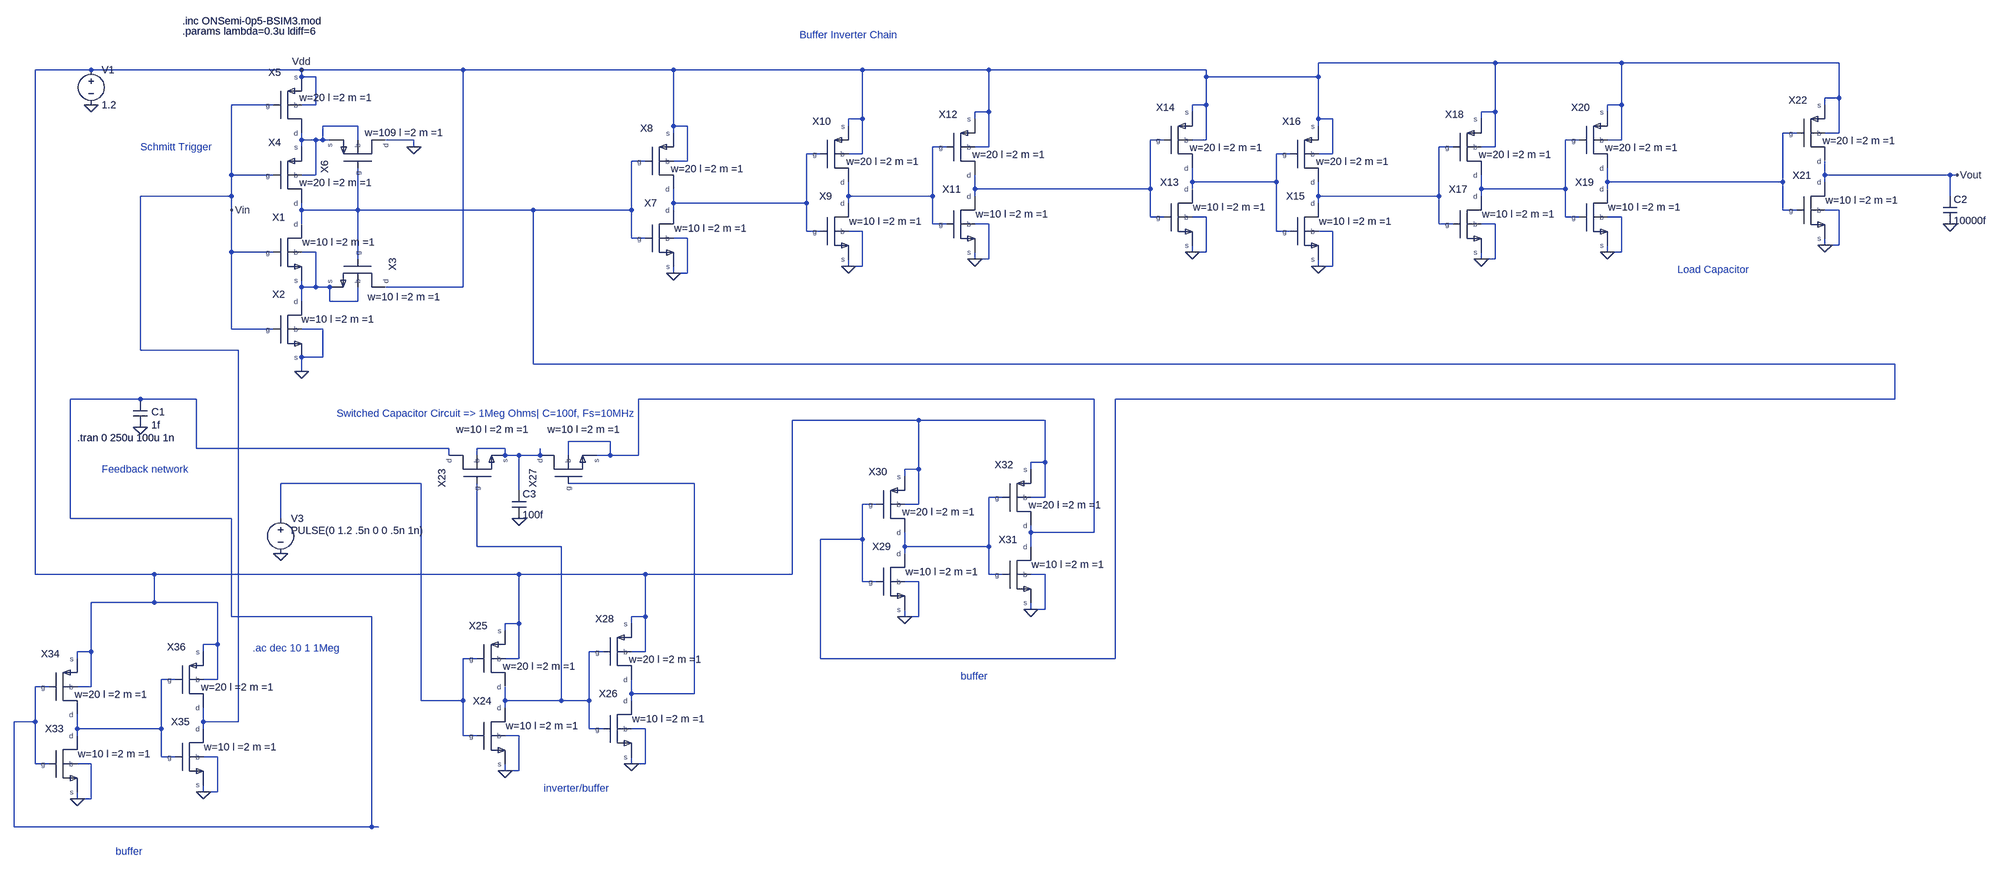
[diagram p0: schematic ECSE426_dp1.asc]
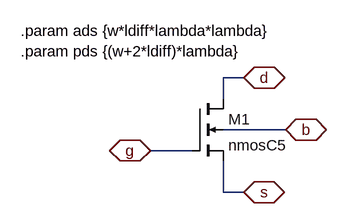
[diagram p1: sub-circuit cmosn.asc]
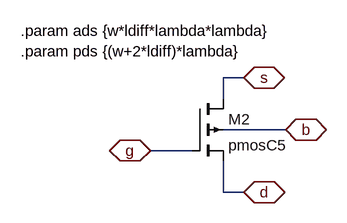
[diagram p2: sub-circuit cmosp.asc]
ECSE426_dp1.asc, the LTspice schematic file:
Version 4
SHEET 1 4220 1496
WIRE 3072 -320 2544 -320
WIRE 3360 -320 3072 -320
WIRE 3856 -320 3360 -320
WIRE -352 -304 -480 -304
WIRE 128 -304 -352 -304
WIRE 496 -304 128 -304
WIRE 976 -304 496 -304
WIRE 1504 -304 976 -304
WIRE 1792 -304 1504 -304
WIRE 2288 -304 1792 -304
WIRE 128 -288 128 -304
WIRE 160 -288 128 -288
WIRE 2288 -288 2288 -304
WIRE 2544 -288 2544 -320
WIRE 2544 -288 2288 -288
WIRE 3856 -240 3856 -320
WIRE 3856 -240 3824 -240
WIRE 64 -224 -32 -224
WIRE 160 -224 160 -288
WIRE 160 -224 128 -224
WIRE 2288 -224 2288 -288
WIRE 2288 -224 2256 -224
WIRE 3360 -224 3360 -320
WIRE 3360 -224 3328 -224
WIRE 3824 -224 3824 -240
WIRE 1792 -208 1792 -304
WIRE 1792 -208 1760 -208
WIRE 2256 -208 2256 -224
WIRE 3072 -208 3072 -320
WIRE 3072 -208 3040 -208
WIRE 3328 -208 3328 -224
WIRE 1504 -192 1504 -304
WIRE 1504 -192 1472 -192
WIRE 1760 -192 1760 -208
WIRE 2544 -192 2544 -288
WIRE 2576 -192 2544 -192
WIRE 3040 -192 3040 -208
WIRE 256 -176 176 -176
WIRE 976 -176 976 -304
WIRE 1008 -176 976 -176
WIRE 1472 -176 1472 -192
WIRE 2544 -176 2544 -192
WIRE 976 -160 976 -176
WIRE 3760 -160 3728 -160
WIRE 3856 -160 3856 -240
WIRE 3856 -160 3824 -160
WIRE 128 -144 128 -160
WIRE 160 -144 128 -144
WIRE 176 -144 176 -176
WIRE 176 -144 160 -144
WIRE 192 -144 176 -144
WIRE 256 -144 256 -176
WIRE 384 -144 320 -144
WIRE 2192 -144 2160 -144
WIRE 2288 -144 2288 -224
WIRE 2288 -144 2256 -144
WIRE 3264 -144 3232 -144
WIRE 3360 -144 3360 -224
WIRE 3360 -144 3328 -144
WIRE 128 -128 128 -144
WIRE 384 -128 384 -144
WIRE 1696 -128 1664 -128
WIRE 1792 -128 1792 -208
WIRE 1792 -128 1760 -128
WIRE 2976 -128 2944 -128
WIRE 3072 -128 3072 -208
WIRE 3072 -128 3040 -128
WIRE 1408 -112 1376 -112
WIRE 1504 -112 1504 -192
WIRE 1504 -112 1472 -112
WIRE 2480 -112 2448 -112
WIRE 2576 -112 2576 -192
WIRE 2576 -112 2544 -112
WIRE 912 -96 880 -96
WIRE 1008 -96 1008 -176
WIRE 1008 -96 976 -96
WIRE -32 -64 -32 -224
WIRE 64 -64 -32 -64
WIRE 160 -64 160 -144
WIRE 160 -64 128 -64
WIRE 3824 -64 3824 -96
WIRE 4128 -64 3824 -64
WIRE 4144 -64 4128 -64
WIRE 2256 -48 2256 -80
WIRE 2448 -48 2448 -112
WIRE 2448 -48 2256 -48
WIRE 3328 -48 3328 -80
WIRE 3728 -48 3728 -160
WIRE 3728 -48 3328 -48
WIRE 3824 -48 3824 -64
WIRE 1760 -32 1760 -64
WIRE 2160 -32 2160 -144
WIRE 2160 -32 1760 -32
WIRE 2256 -32 2256 -48
WIRE 3040 -32 3040 -64
WIRE 3232 -32 3232 -144
WIRE 3232 -32 3040 -32
WIRE 3328 -32 3328 -48
WIRE -32 -16 -32 -64
WIRE -32 -16 -240 -16
WIRE 1472 -16 1472 -48
WIRE 1664 -16 1664 -128
WIRE 1664 -16 1472 -16
WIRE 1760 -16 1760 -32
WIRE 2544 -16 2544 -48
WIRE 2944 -16 2944 -128
WIRE 2944 -16 2544 -16
WIRE 3040 -16 3040 -32
WIRE 4128 -16 4128 -64
WIRE 976 0 976 -32
WIRE 1376 0 1376 -112
WIRE 1376 0 976 0
WIRE 1472 0 1472 -16
WIRE 2544 0 2544 -16
WIRE -32 16 -32 -16
WIRE 128 16 128 0
WIRE 256 16 256 -80
WIRE 256 16 128 16
WIRE 656 16 256 16
WIRE 880 16 880 -96
WIRE 880 16 656 16
WIRE 976 16 976 0
WIRE 3728 16 3728 -48
WIRE 3760 16 3728 16
WIRE 3856 16 3824 16
WIRE 2160 32 2160 -32
WIRE 2192 32 2160 32
WIRE 2288 32 2256 32
WIRE 3232 32 3232 -32
WIRE 3264 32 3232 32
WIRE 3360 32 3328 32
WIRE 128 48 128 16
WIRE 1664 48 1664 -16
WIRE 1696 48 1664 48
WIRE 1792 48 1760 48
WIRE 2944 48 2944 -16
WIRE 2976 48 2944 48
WIRE 3072 48 3040 48
WIRE 1376 64 1376 0
WIRE 1408 64 1376 64
WIRE 1504 64 1472 64
WIRE 2448 64 2448 -48
WIRE 2480 64 2448 64
WIRE 2576 64 2544 64
WIRE 880 80 880 16
WIRE 912 80 880 80
WIRE 1008 80 976 80
WIRE 3824 96 3824 80
WIRE 3856 96 3856 16
WIRE 3856 96 3824 96
WIRE -32 112 -32 16
WIRE 64 112 -32 112
WIRE 160 112 128 112
WIRE 2256 112 2256 96
WIRE 2288 112 2288 32
WIRE 2288 112 2256 112
WIRE 3328 112 3328 96
WIRE 3360 112 3360 32
WIRE 3360 112 3328 112
WIRE 256 128 256 16
WIRE 1760 128 1760 112
WIRE 1792 128 1792 48
WIRE 1792 128 1760 128
WIRE 3040 128 3040 112
WIRE 3072 128 3072 48
WIRE 3072 128 3040 128
WIRE 1472 144 1472 128
WIRE 1504 144 1504 64
WIRE 1504 144 1472 144
WIRE 2544 144 2544 128
WIRE 2576 144 2576 64
WIRE 2576 144 2544 144
WIRE 976 160 976 144
WIRE 1008 160 1008 80
WIRE 1008 160 976 160
WIRE 128 192 128 176
WIRE 160 192 160 112
WIRE 160 192 128 192
WIRE 192 192 160 192
WIRE 496 192 496 -304
WIRE 496 192 320 192
WIRE 128 224 128 192
WIRE 192 224 192 192
WIRE 256 224 256 192
WIRE 256 224 192 224
WIRE -32 288 -32 112
WIRE 64 288 -32 288
WIRE 176 288 128 288
WIRE -240 336 -240 -16
WIRE -16 336 -240 336
WIRE 176 352 176 288
WIRE 176 352 128 352
WIRE 656 368 656 16
WIRE 3984 368 656 368
WIRE 128 384 128 352
WIRE -240 448 -400 448
WIRE -112 448 -240 448
WIRE 2032 448 896 448
WIRE 3984 448 3984 368
WIRE 3984 448 2080 448
WIRE 1632 496 1344 496
WIRE 1920 496 1632 496
WIRE 832 544 736 544
WIRE -112 560 -112 448
WIRE 464 560 -112 560
WIRE 592 560 528 560
WIRE 464 576 464 560
WIRE 528 576 528 560
WIRE 592 576 592 560
WIRE 624 576 592 576
WIRE 672 576 672 560
WIRE 672 576 624 576
WIRE 736 576 736 544
WIRE 832 576 832 544
WIRE 832 576 800 576
WIRE 896 576 896 448
WIRE 896 576 832 576
WIRE 1920 592 1920 496
WIRE 1920 592 1888 592
WIRE 1632 608 1632 496
WIRE 1632 608 1600 608
WIRE 1888 608 1888 592
WIRE 1600 624 1600 608
WIRE 400 640 80 640
WIRE 1024 640 736 640
WIRE 624 656 624 576
WIRE 1824 672 1792 672
WIRE 1920 672 1920 592
WIRE 1920 672 1888 672
WIRE 1536 688 1504 688
WIRE 1632 688 1632 608
WIRE 1632 688 1600 688
WIRE -400 720 -400 448
WIRE -32 720 -400 720
WIRE 80 720 80 640
WIRE 1888 752 1888 736
WIRE 2032 752 2032 448
WIRE 2032 752 1888 752
WIRE 1504 768 1504 688
WIRE 1504 768 1408 768
WIRE 528 784 528 640
WIRE 720 784 528 784
WIRE 1600 784 1600 752
WIRE 1792 784 1792 672
WIRE 1792 784 1600 784
WIRE 1888 784 1888 752
WIRE 1600 800 1600 784
WIRE -480 848 -480 -304
WIRE -208 848 -480 848
WIRE 624 848 -208 848
WIRE 912 848 624 848
WIRE 1344 848 1344 496
WIRE 1344 848 912 848
WIRE 1792 848 1792 784
WIRE 1824 848 1792 848
WIRE 1920 848 1888 848
WIRE 1504 864 1504 768
WIRE 1536 864 1504 864
WIRE 1632 864 1600 864
WIRE -208 912 -208 848
WIRE -208 912 -352 912
WIRE -64 912 -208 912
WIRE 1888 928 1888 912
WIRE 1920 928 1920 848
WIRE 1920 928 1888 928
WIRE -32 944 -32 720
WIRE 288 944 -32 944
WIRE 912 944 912 848
WIRE 912 944 880 944
WIRE 1600 944 1600 928
WIRE 1632 944 1632 864
WIRE 1632 944 1600 944
WIRE 624 960 624 848
WIRE 624 960 592 960
WIRE 880 960 880 944
WIRE 592 976 592 960
WIRE -64 1008 -64 912
WIRE -64 1008 -96 1008
WIRE -352 1024 -352 912
WIRE -352 1024 -384 1024
WIRE -96 1024 -96 1008
WIRE 816 1024 784 1024
WIRE 912 1024 912 944
WIRE 912 1024 880 1024
WIRE -384 1040 -384 1024
WIRE 528 1040 496 1040
WIRE 624 1040 624 960
WIRE 624 1040 592 1040
WIRE 1408 1040 1408 768
WIRE 2080 1040 2080 448
WIRE 2080 1040 1408 1040
WIRE -160 1088 -192 1088
WIRE -64 1088 -64 1008
WIRE -64 1088 -96 1088
WIRE -448 1104 -480 1104
WIRE -352 1104 -352 1024
WIRE -352 1104 -384 1104
WIRE 880 1120 880 1088
WIRE 1024 1120 1024 640
WIRE 1024 1120 880 1120
WIRE 400 1136 400 640
WIRE 496 1136 496 1040
WIRE 496 1136 400 1136
WIRE 592 1136 592 1104
WIRE 720 1136 720 784
WIRE 720 1136 592 1136
WIRE 784 1136 784 1024
WIRE 784 1136 720 1136
WIRE 880 1136 880 1120
WIRE 592 1152 592 1136
WIRE -480 1184 -480 1104
WIRE -480 1184 -528 1184
WIRE -96 1184 -96 1152
WIRE -16 1184 -16 336
WIRE -16 1184 -96 1184
WIRE -384 1200 -384 1168
WIRE -192 1200 -192 1088
WIRE -192 1200 -384 1200
WIRE -96 1200 -96 1184
WIRE 784 1200 784 1136
WIRE 816 1200 784 1200
WIRE 912 1200 880 1200
WIRE -384 1216 -384 1200
WIRE 496 1216 496 1136
WIRE 528 1216 496 1216
WIRE 624 1216 592 1216
WIRE -192 1264 -192 1200
WIRE -160 1264 -192 1264
WIRE -64 1264 -96 1264
WIRE -480 1280 -480 1184
WIRE -448 1280 -480 1280
WIRE -352 1280 -384 1280
WIRE 880 1280 880 1264
WIRE 912 1280 912 1200
WIRE 912 1280 880 1280
WIRE 592 1296 592 1280
WIRE 624 1296 624 1216
WIRE 624 1296 592 1296
WIRE -96 1344 -96 1328
WIRE -64 1344 -64 1264
WIRE -64 1344 -96 1344
WIRE -384 1360 -384 1344
WIRE -352 1360 -352 1280
WIRE -352 1360 -384 1360
WIRE -528 1424 -528 1184
WIRE 288 1424 288 944
WIRE 288 1424 -528 1424
WIRE 304 1424 288 1424
FLAG 128 384 0
FLAG 384 -128 0
FLAG -352 -224 0
FLAG 128 -304 Vdd
FLAG -32 16 Vin
FLAG -240 512 0
FLAG 976 160 0
FLAG 1472 144 0
FLAG 1760 128 0
FLAG 2256 112 0
FLAG 4128 48 0
FLAG 2544 144 0
FLAG 3040 128 0
FLAG 4144 -64 Vout
FLAG 3328 112 0
FLAG 3824 96 0
FLAG 624 720 0
FLAG 80 800 0
FLAG 592 1296 0
FLAG 880 1280 0
FLAG 1600 944 0
FLAG 1888 928 0
FLAG -384 1360 0
FLAG -96 1344 0
SYMBOL CMOSN 112 112 R0
WINDOW 39 101 -7 Bottom 2
SYMATTR SpiceLine w=10 l =2 m =1
SYMATTR InstName X1
SYMBOL CMOSN 112 288 R0
WINDOW 39 99 -7 Bottom 2
SYMATTR SpiceLine w=10 l =2 m =1
SYMATTR InstName X2
SYMBOL CMOSN 256 176 R90
WINDOW 39 23 -106 VTop 2
SYMATTR SpiceLine w=10 l =2 m =1
SYMATTR InstName X3
SYMBOL CMOSP 96 -64 R0
WINDOW 39 110 33 Bottom 2
SYMATTR SpiceLine w=20 l =2 m =1
SYMATTR InstName X4
SYMBOL CMOSP 96 -224 R0
WINDOW 39 110 -1 Bottom 2
SYMATTR SpiceLine w=20 l =2 m =1
SYMATTR InstName X5
SYMBOL CMOSP 256 -112 R270
WINDOW 39 33 106 VTop 2
SYMATTR SpiceLine w=109 l =2 m =1
SYMATTR InstName X6
SYMBOL voltage -352 -320 R0
WINDOW 123 0 0 Left 0
WINDOW 39 0 0 Left 0
SYMATTR InstName V1
SYMATTR Value 1.2
SYMBOL cap -256 448 R0
WINDOW 0 41 29 Left 2
WINDOW 3 41 59 Left 2
SYMATTR InstName C1
SYMATTR Value 1f
SYMBOL CMOSN 960 80 R0
WINDOW 39 101 -7 Bottom 2
SYMATTR SpiceLine w=10 l =2 m =1
SYMATTR InstName X7
SYMBOL CMOSP 944 -96 R0
WINDOW 39 110 33 Bottom 2
SYMATTR SpiceLine w=20 l =2 m =1
SYMATTR InstName X8
SYMBOL CMOSN 1456 64 R0
WINDOW 39 101 -7 Bottom 2
SYMATTR SpiceLine w=10 l =2 m =1
SYMATTR InstName X9
SYMBOL CMOSP 1440 -112 R0
WINDOW 39 110 33 Bottom 2
SYMATTR SpiceLine w=20 l =2 m =1
SYMATTR InstName X10
SYMBOL CMOSN 1744 48 R0
WINDOW 39 101 -7 Bottom 2
SYMATTR SpiceLine w=10 l =2 m =1
SYMATTR InstName X11
SYMBOL CMOSP 1728 -128 R0
WINDOW 39 110 33 Bottom 2
SYMATTR SpiceLine w=20 l =2 m =1
SYMATTR InstName X12
SYMBOL CMOSN 2240 32 R0
WINDOW 39 101 -7 Bottom 2
SYMATTR SpiceLine w=10 l =2 m =1
SYMATTR InstName X13
SYMBOL CMOSP 2224 -144 R0
WINDOW 39 110 33 Bottom 2
SYMATTR SpiceLine w=20 l =2 m =1
SYMATTR InstName X14
SYMBOL cap 4112 -16 R0
SYMATTR InstName C2
SYMATTR Value 10000f
SYMBOL CMOSN 2528 64 R0
WINDOW 39 101 -7 Bottom 2
SYMATTR SpiceLine w=10 l =2 m =1
SYMATTR InstName X15
SYMBOL CMOSP 2512 -112 R0
WINDOW 39 110 33 Bottom 2
SYMATTR SpiceLine w=20 l =2 m =1
SYMATTR InstName X16
SYMBOL CMOSN 3024 48 R0
WINDOW 39 101 -7 Bottom 2
SYMATTR SpiceLine w=10 l =2 m =1
SYMATTR InstName X17
SYMBOL CMOSP 3008 -128 R0
WINDOW 39 110 33 Bottom 2
SYMATTR SpiceLine w=20 l =2 m =1
SYMATTR InstName X18
SYMBOL CMOSN 3312 32 R0
WINDOW 39 101 -7 Bottom 2
SYMATTR SpiceLine w=10 l =2 m =1
SYMATTR InstName X19
SYMBOL CMOSP 3296 -144 R0
WINDOW 39 110 33 Bottom 2
SYMATTR SpiceLine w=20 l =2 m =1
SYMATTR InstName X20
SYMBOL CMOSN 3808 16 R0
WINDOW 39 101 -7 Bottom 2
SYMATTR SpiceLine w=10 l =2 m =1
SYMATTR InstName X21
SYMBOL CMOSP 3792 -160 R0
WINDOW 39 110 33 Bottom 2
SYMATTR SpiceLine w=20 l =2 m =1
SYMATTR InstName X22
SYMBOL cap 608 656 R0
SYMATTR InstName C3
SYMATTR Value 100f
SYMBOL voltage 80 704 R0
WINDOW 3 24 44 Left 2
WINDOW 123 24 72 Left 2
WINDOW 39 0 0 Left 0
SYMATTR Value PULSE(0 1.2 .5n 0 0 .5n 1n)
SYMATTR InstName V3
SYMBOL CMOSN 736 592 R270
WINDOW 39 60 36 VTop 2
SYMATTR SpiceLine w=10 l =2 m =1
SYMATTR InstName X27
SYMBOL CMOSN 528 592 R270
WINDOW 39 60 36 VTop 2
SYMATTR SpiceLine w=10 l =2 m =1
SYMATTR InstName X23
SYMBOL CMOSN 576 1216 R0
WINDOW 39 101 -7 Bottom 2
SYMATTR SpiceLine w=10 l =2 m =1
SYMATTR InstName X24
SYMBOL CMOSP 560 1040 R0
WINDOW 39 110 33 Bottom 2
SYMATTR SpiceLine w=20 l =2 m =1
SYMATTR InstName X25
SYMBOL CMOSN 864 1200 R0
WINDOW 39 101 -7 Bottom 2
SYMATTR SpiceLine w=10 l =2 m =1
SYMATTR InstName X26
SYMBOL CMOSP 848 1024 R0
WINDOW 39 110 33 Bottom 2
SYMATTR SpiceLine w=20 l =2 m =1
SYMATTR InstName X28
SYMBOL CMOSN 1584 864 R0
WINDOW 39 101 -7 Bottom 2
SYMATTR SpiceLine w=10 l =2 m =1
SYMATTR InstName X29
SYMBOL CMOSP 1568 688 R0
WINDOW 39 110 33 Bottom 2
SYMATTR SpiceLine w=20 l =2 m =1
SYMATTR InstName X30
SYMBOL CMOSN 1872 848 R0
WINDOW 39 101 -7 Bottom 2
SYMATTR SpiceLine w=10 l =2 m =1
SYMATTR InstName X31
SYMBOL CMOSP 1856 672 R0
WINDOW 39 110 33 Bottom 2
SYMATTR SpiceLine w=20 l =2 m =1
SYMATTR InstName X32
SYMBOL CMOSN -400 1280 R0
WINDOW 39 101 -7 Bottom 2
SYMATTR SpiceLine w=10 l =2 m =1
SYMATTR InstName X33
SYMBOL CMOSP -416 1104 R0
WINDOW 39 110 33 Bottom 2
SYMATTR SpiceLine w=20 l =2 m =1
SYMATTR InstName X34
SYMBOL CMOSN -112 1264 R0
WINDOW 39 101 -7 Bottom 2
SYMATTR SpiceLine w=10 l =2 m =1
SYMATTR InstName X35
SYMBOL CMOSP -128 1088 R0
WINDOW 39 110 33 Bottom 2
SYMATTR SpiceLine w=20 l =2 m =1
SYMATTR InstName X36
TEXT -144 -392 Left 2 !.params lambda=0.3u ldiff=6
TEXT -144 -416 Left 2 !.inc ONSemi-0p5-BSIM3.mod
TEXT -384 536 Left 2 !.tran 0 250u 100u 1n
TEXT 16 1016 Left 2 ;.ac dec 10 1 1Meg
TEXT 208 480 Left 2 ;Switched Capacitor Circuit => 1Meg Ohms| C=100f, Fs=10MHz
TEXT -240 -128 Left 2 ;Schmitt Trigger
TEXT 1360 -384 Left 2 ;Buffer Inverter Chain
TEXT 3488 152 Left 2 ;Load Capacitor
TEXT -328 608 Left 2 ;Feedback network
TEXT -296 1480 Left 2 ;buffer
TEXT 1728 1080 Left 2 ;buffer
TEXT 680 1336 Left 2 ;inverter/buffer

cmosn.asc, the sub-circuit schematic file:
Version 4
SHEET 1 1648 680
WIRE 240 144 208 144
WIRE 208 176 208 144
WIRE 304 224 208 224
WIRE 160 256 96 256
WIRE 208 320 208 272
WIRE 240 320 208 320
FLAG 96 256 g
IOPIN 96 256 BiDir
FLAG 240 144 d
IOPIN 240 144 BiDir
FLAG 240 320 s
IOPIN 240 320 BiDir
FLAG 304 224 b
IOPIN 304 224 BiDir
SYMBOL nmos4 160 176 R0
SYMATTR InstName M1
SYMATTR Value nmosC5
SYMATTR Value2 l={l*lambda} w={w*lambda} ad={ads} as={ads} pd={pds} ps={pds} m={m}
TEXT -104 72 Left 2 !.param ads {w*ldiff*lambda*lambda}\n.param pds {(w+2*ldiff)*lambda}

cmosp.asc, the sub-circuit schematic file:
Version 4
SHEET 1 1648 680
WIRE 240 144 208 144
WIRE 208 176 208 144
WIRE 304 224 208 224
WIRE 160 256 96 256
WIRE 208 320 208 272
WIRE 240 320 208 320
FLAG 96 256 g
IOPIN 96 256 BiDir
FLAG 240 320 d
IOPIN 240 320 BiDir
FLAG 240 144 s
IOPIN 240 144 BiDir
FLAG 304 224 b
IOPIN 304 224 BiDir
SYMBOL pmos4 160 176 R0
SYMATTR InstName M2
SYMATTR Value pmosC5
SYMATTR Value2 l={l*lambda} w={w*lambda} ad={ads} as={ads} pd={pds} ps={pds} m={m}
TEXT -104 72 Left 2 !.param ads {w*ldiff*lambda*lambda}\n.param pds {(w+2*ldiff)*lambda}

The netlist it stands for:
* ECSE426_dp1.asc
XX1 N010 N009 Vin N010 cmosn params: w=10 l =2 m =1
XX2 0 N010 Vin 0 cmosn params: w=10 l =2 m =1
XX3 N010 Vdd N009 N010 cmosn params: w=10 l =2 m =1
XX4 N001 N009 Vin N001 cmosp params: w=20 l =2 m =1
XX5 Vdd N001 Vin Vdd cmosp params: w=20 l =2 m =1
XX6 N001 0 N009 N001 cmosp params: w=109 l =2 m =1
V1 Vdd 0 1.2
C1 N011 0 1f
XX7 0 N007 N009 0 cmosn params: w=10 l =2 m =1
XX8 Vdd N007 N009 Vdd cmosp params: w=20 l =2 m =1
XX9 0 N005 N007 0 cmosn params: w=10 l =2 m =1
XX10 Vdd N005 N007 Vdd cmosp params: w=20 l =2 m =1
XX11 0 N003 N005 0 cmosn params: w=10 l =2 m =1
XX12 Vdd N003 N005 Vdd cmosp params: w=20 l =2 m =1
XX13 0 N008 N003 0 cmosn params: w=10 l =2 m =1
XX14 Vdd N008 N003 Vdd cmosp params: w=20 l =2 m =1
C2 Vout 0 10000f
XX15 0 N006 N008 0 cmosn params: w=10 l =2 m =1
XX16 Vdd N006 N008 Vdd cmosp params: w=20 l =2 m =1
XX17 0 N004 N006 0 cmosn params: w=10 l =2 m =1
XX18 Vdd N004 N006 Vdd cmosp params: w=20 l =2 m =1
XX19 0 N002 N004 0 cmosn params: w=10 l =2 m =1
XX20 Vdd N002 N004 Vdd cmosp params: w=20 l =2 m =1
XX21 0 Vout N002 0 cmosn params: w=10 l =2 m =1
XX22 Vdd Vout N002 Vdd cmosp params: w=20 l =2 m =1
C3 N013 0 100f
V3 N014 0 PULSE(0 1.2 .5n 0 0 .5n 1n)
XX27 N012 N013 N015 N012 cmosn params: w=10 l =2 m =1
XX23 N013 N011 N017 N013 cmosn params: w=10 l =2 m =1
XX24 0 N017 N014 0 cmosn params: w=10 l =2 m =1
XX25 Vdd N017 N014 Vdd cmosp params: w=20 l =2 m =1
XX26 0 N015 N017 0 cmosn params: w=10 l =2 m =1
XX28 Vdd N015 N017 Vdd cmosp params: w=20 l =2 m =1
XX29 0 N016 N009 0 cmosn params: w=10 l =2 m =1
XX30 Vdd N016 N009 Vdd cmosp params: w=20 l =2 m =1
XX31 0 N012 N016 0 cmosn params: w=10 l =2 m =1
XX32 Vdd N012 N016 Vdd cmosp params: w=20 l =2 m =1
XX33 0 N018 N011 0 cmosn params: w=10 l =2 m =1
XX34 Vdd N018 N011 Vdd cmosp params: w=20 l =2 m =1
XX35 0 Vin N018 0 cmosn params: w=10 l =2 m =1
XX36 Vdd Vin N018 Vdd cmosp params: w=20 l =2 m =1

* block symbol definitions
.subckt cmosn b d g s
M1 d g s b nmosC5 l={l*lambda} w={w*lambda} ad={ads} as={ads} pd={pds} ps={pds} m={m}
.param ads {w*ldiff*lambda*lambda}
.param pds {(w+2*ldiff)*lambda}
.ends cmosn

.subckt cmosp b d g s
M2 s g d b pmosC5 l={l*lambda} w={w*lambda} ad={ads} as={ads} pd={pds} ps={pds} m={m}
.param ads {w*ldiff*lambda*lambda}
.param pds {(w+2*ldiff)*lambda}
.ends cmosp

.model NMOS NMOS
.model PMOS PMOS
.lib standard.mos
.params lambda=0.3u ldiff=6
.inc ONSemi-0p5-BSIM3.mod
.tran 0 250u 100u 1n
* .ac dec 10 1 1Meg
* Switched Capacitor Circuit => 1Meg Ohms| C=100f, Fs=10MHz
* Schmitt Trigger
* Buffer Inverter Chain
* Load Capacitor
* Feedback network
* buffer
* buffer
* inverter/buffer
.backanno
.end